# Altium schematic sheet Noise Diode.SchDoc
size A
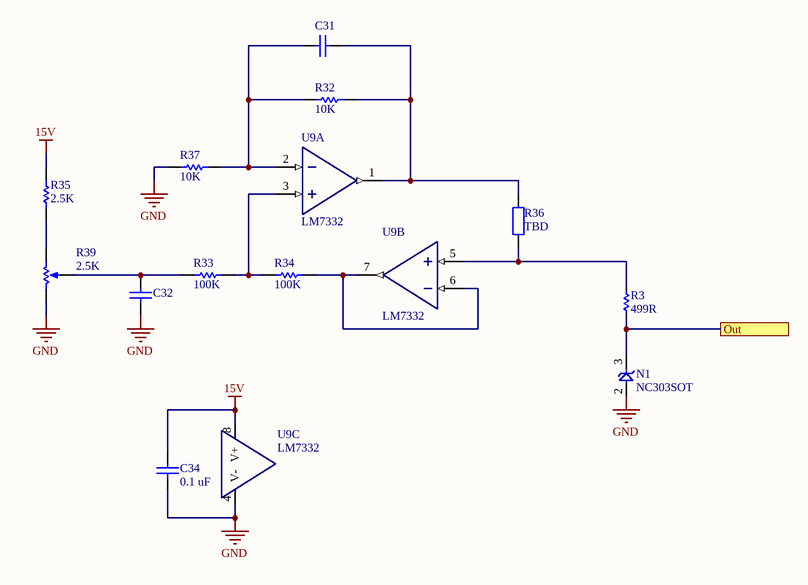
[diagram p0: Noise Diode.SchDoc]

## Parts
C31  Cap  [0603C]  (value not drawn)
C32  Cap  [0603C]  (value not drawn)
C34  value 0.1 uF  [0603C]  (hidden comment: Cap)
N1  NC303SOT  [SOT323-3AN]
R3  value 499R  [1206R]  (hidden comment: Res Semi Small)
R32  value 10K  [0603R]  (hidden comment: Res Semi)
R33  value 100K  [0603R]  (hidden comment: Res Semi)
R34  value 100K  [0603R]  (hidden comment: Res Semi)
R35  value 2.5K  [1206R]  (hidden comment: Res Semi)
R36  value TBD  [1206R]  (hidden comment: Res2)
R37  value 10K  [0603R]  (hidden comment: Res Semi)
R39  2.5K  [Bourns 3269W - 12 Turn SMT Trimpot]
U9  LM7332  [SOIC127P600-8CN]  (parts A,B,C of 3)

## Ports
Out

## Nets
15V: C34.2 R35.2 U9.8(V+)
GND: C32.1 C34.1 N1.2(A) R37.1 R39.3(BOT) U9.4(V-)
Out: N1.3(C) R3.1 ; port Out
NetC31_1: C31.1 R32.1 R37.2 U9.2(In_A_-)
NetC31_2: C31.2 R32.2 R36.2 U9.1(Out_A)
NetC32_2: C32.2 R33.1 R39.2(TAP)
NetR3_2: R3.2 R36.1 U9.5(In_B_+)
NetR33_2: R33.2 R34.1 U9.3(In_A_+)
NetR34_2: R34.2 U9.6(In_B_-) U9.7(Out_B)
NetR35_1: R35.1 R39.1(TOP)

## Library data of the parts
C31 C32 = Cap: Capacitor; Value: 100pF; Published: 8-Jun-2000; LatestRevisionDate: 17-Jul-2002; LatestRevisionNote: Re-released for DXP Platform.; PackageReference: RAD-0.3; Publisher: Altium Limited
C34 = Cap: Capacitor; Published: 8-Jun-2000; LatestRevisionDate: 17-Jul-2002; LatestRevisionNote: Re-released for DXP Platform.; PackageReference: RAD-0.3; Publisher: Altium Limited
N1 = NC303SOT: SMT Noise Diode
R3 = Res Semi Small: Semiconductor Resistor; Published: 8-Jun-2000; LatestRevisionDate: 17-Jul-2002; LatestRevisionNote: Re-released for DXP Platform.; PackageReference: AXIAL-0.5; Publisher: Altium Limited
R32-R35 R37 = Res Semi: Semiconductor Resistor; Published: 8-Jun-2000; LatestRevisionDate: 17-Jul-2002; LatestRevisionNote: Re-released for DXP Platform.; PackageReference: AXIAL-0.5; Publisher: Altium Limited
R36 = Res2: Resistor; Published: 8-Jun-2000; LatestRevisionDate: 17-Jul-2002; LatestRevisionNote: Re-released for DXP Platform.; PackageReference: AXIAL-0.4; Publisher: Altium Limited
R39 = RPot: Potentiometer; Sim Note: Enter the Resistance value and the set point into parameter fields.; Set Position: 0.5; Published: 8-Jun-2000; LatestRevisionDate: 17-Jul-2002; LatestRevisionNote: Re-released for DXP Platform.; PackageReference: VR5; Publisher: Altium Limited
U9 = LM7332: Dual Rail-to-Rail Input/Output, 30V, Wide Voltage Range, High Output Operational Amplifier; Datasheet: http://www.analog.com/static/imported-files/data_sheets/AD822.pdf